# EAGLE design 2030_LED_Driver (EAGLE 7.7.0)
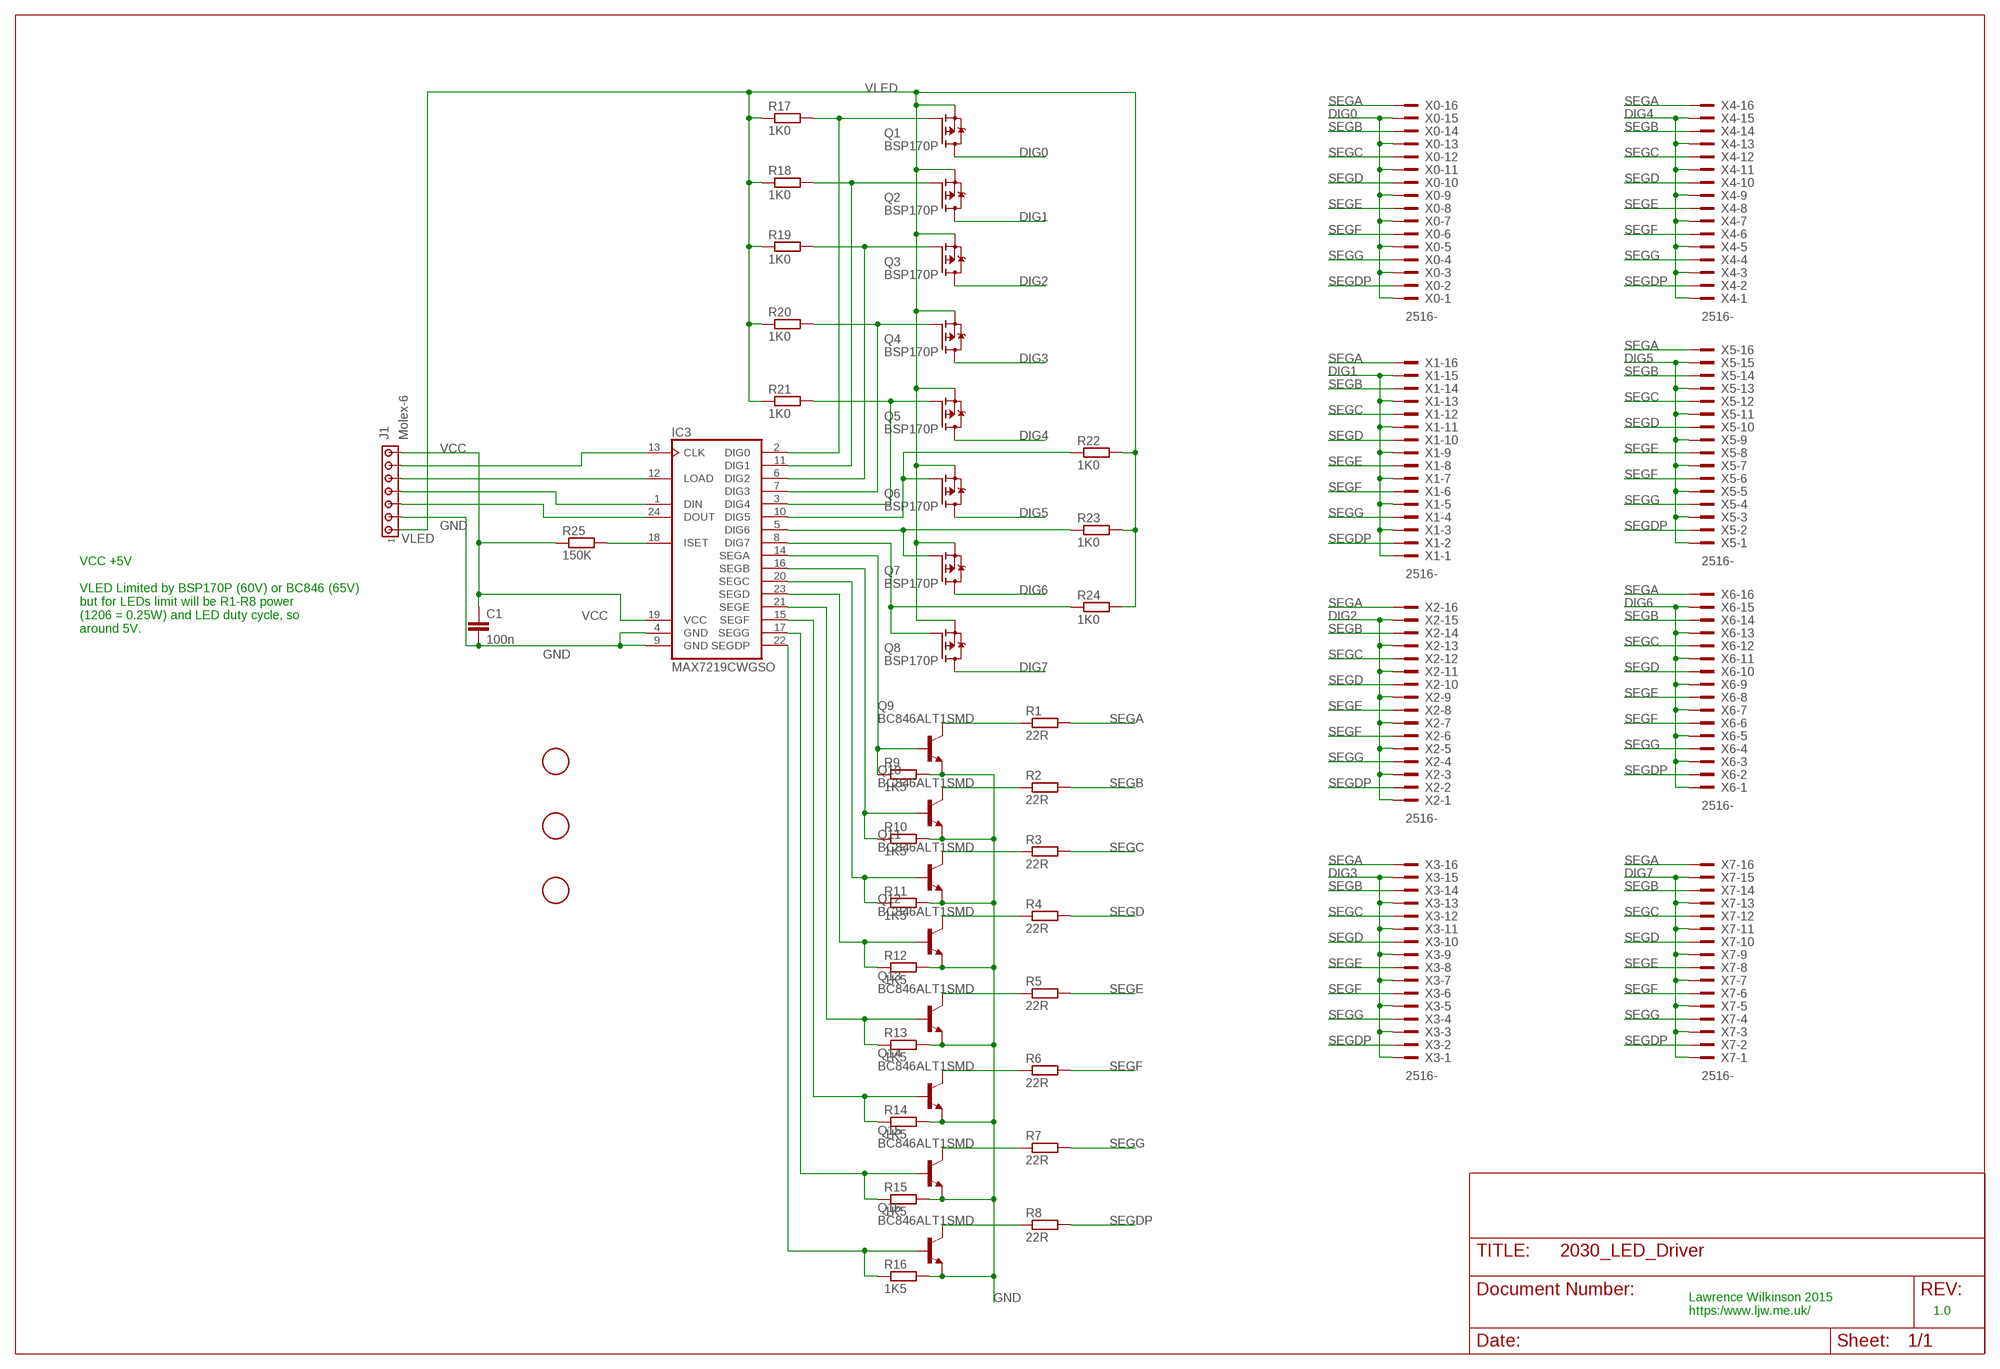
[diagram p0: schematic, sheet 1]

## Parts
C1  100n  C-EUC1206  [C1206]
IC3  MAX7219CWGSO  [SO24L]
J1  Molex-6  MTA07-100  [10X07MTA]
Q1  BSP170P  [SOT223]
Q2  BSP170P  [SOT223]
Q3  BSP170P  [SOT223]
Q4  BSP170P  [SOT223]
Q5  BSP170P  [SOT223]
Q6  BSP170P  [SOT223]
Q7  BSP170P  [SOT223]
Q8  BSP170P  [SOT223]
Q9  BC846ALT1SMD  [SOT23]
Q10  BC846ALT1SMD  [SOT23]
Q11  BC846ALT1SMD  [SOT23]
Q12  BC846ALT1SMD  [SOT23]
Q13  BC846ALT1SMD  [SOT23]
Q14  BC846ALT1SMD  [SOT23]
Q15  BC846ALT1SMD  [SOT23]
Q16  BC846ALT1SMD  [SOT23]
R1  22R  R-EU_M1206  [M1206]
R2  22R  R-EU_M1206  [M1206]
R3  22R  R-EU_M1206  [M1206]
R4  22R  R-EU_M1206  [M1206]
R5  22R  R-EU_M1206  [M1206]
R6  22R  R-EU_M1206  [M1206]
R7  22R  R-EU_M1206  [M1206]
R8  22R  R-EU_M1206  [M1206]
R9  1K5  R-EU_M0805  [M0805]
R10  1K5  R-EU_M0805  [M0805]
R11  1K5  R-EU_M0805  [M0805]
R12  1K5  R-EU_M0805  [M0805]
R13  1K5  R-EU_M0805  [M0805]
R14  1K5  R-EU_M0805  [M0805]
R15  1K5  R-EU_M0805  [M0805]
R16  1K5  R-EU_M0805  [M0805]
R17  1K0  R-EU_M0805  [M0805]
R18  1K0  R-EU_M0805  [M0805]
R19  1K0  R-EU_M0805  [M0805]
R20  1K0  R-EU_M0805  [M0805]
R21  1K0  R-EU_M0805  [M0805]
R22  1K0  R-EU_M0805  [M0805]
R23  1K0  R-EU_M0805  [M0805]
R24  1K0  R-EU_M0805  [M0805]
R25  150K  R-EU_M0805  [M0805]
U$1  FIDUCIAL  [FIDUCIAL_1MM]
U$2  FIDUCIAL  [FIDUCIAL_1MM]
U$3  FIDUCIAL  [FIDUCIAL_1MM]
X0  2516-  [PAK100/2500-16]
X1  2516-  [PAK100/2500-16]
X2  2516-  [PAK100/2500-16]
X3  2516-  [PAK100/2500-16]
X4  2516-  [PAK100/2500-16]
X5  2516-  [PAK100/2500-16]
X6  2516-  [PAK100/2500-16]
X7  2516-  [PAK100/2500-16]

## Nets
CLK: IC3.13(CLK) J1.6
DIG0 [supply]: Q1.2(D) Q1.4(D) X0.1 X0.3 X0.5 X0.7 X0.9 X0.11 X0.13 X0.15
DIG1 [supply]: Q2.2(D) Q2.4(D) X1.1 X1.3 X1.5 X1.7 X1.9 X1.11 X1.13 X1.15
DIG2 [supply]: Q3.2(D) Q3.4(D) X2.1 X2.3 X2.5 X2.7 X2.9 X2.11 X2.13 X2.15
DIG3 [supply]: Q4.2(D) Q4.4(D) X3.1 X3.3 X3.5 X3.7 X3.9 X3.11 X3.13 X3.15
DIG4 [supply]: Q5.2(D) Q5.4(D) X4.1 X4.3 X4.5 X4.7 X4.9 X4.11 X4.13 X4.15
DIG5 [supply]: Q6.2(D) Q6.4(D) X5.1 X5.3 X5.5 X5.7 X5.9 X5.11 X5.13 X5.15
DIG6 [supply]: Q7.2(D) Q7.4(D) X6.1 X6.3 X6.5 X6.7 X6.9 X6.11 X6.13 X6.15
DIG7 [supply]: Q8.2(D) Q8.4(D) X7.1 X7.3 X7.5 X7.7 X7.9 X7.11 X7.13 X7.15
DIN: IC3.1(DIN) J1.4
DOUT: IC3.24(DOUT) J1.3
GND [supply]: C1.2 IC3.4(GND) IC3.9(GND) J1.2 Q9.2(E) Q10.2(E) Q11.2(E) Q12.2(E) Q13.2(E) Q14.2(E) Q15.2(E) Q16.2(E) R9.2 R10.2 R11.2 R12.2 R13.2 R14.2 R15.2 R16.2
LOAD: IC3.12(LOAD) J1.5
N$2: IC3.2(DIG0) Q1.1(G) R17.2
N$3: IC3.11(DIG1) Q2.1(G) R18.2
N$4: IC3.6(DIG2) Q3.1(G) R19.2
N$5: IC3.7(DIG3) Q4.1(G) R20.2
N$6: IC3.3(DIG4) Q5.1(G) R21.2
N$7: IC3.10(DIG5) Q6.1(G) R22.1
N$8: IC3.5(DIG6) Q7.1(G) R23.1
N$9: IC3.8(DIG7) Q8.1(G) R24.1
N$10: IC3.18(ISET) R25.2
N$17: Q9.3(C) R1.1
N$18: Q10.3(C) R2.1
N$19: Q11.3(C) R3.1
N$20: Q12.3(C) R4.1
N$21: Q13.3(C) R5.1
N$22: IC3.14(SEGA) Q9.1(B) R9.1
N$23: IC3.16(SEGB) Q10.1(B) R10.1
N$24: IC3.20(SEGC) Q11.1(B) R11.1
N$25: IC3.23(SEGD) Q12.1(B) R12.1
N$26: IC3.21(SEGE) Q13.1(B) R13.1
N$27: IC3.15(SEGF) Q14.1(B) R14.1
N$28: IC3.17(SEGG) Q15.1(B) R15.1
N$29: IC3.22(SEGDP) Q16.1(B) R16.1
N$30: Q14.3(C) R6.1
N$31: Q15.3(C) R7.1
N$32: Q16.3(C) R8.1
SEGA: R1.2 X0.16 X1.16 X2.16 X3.16 X4.16 X5.16 X6.16 X7.16
SEGB: R2.2 X0.14 X1.14 X2.14 X3.14 X4.14 X5.14 X6.14 X7.14
SEGC: R3.2 X0.12 X1.12 X2.12 X3.12 X4.12 X5.12 X6.12 X7.12
SEGD: R4.2 X0.10 X1.10 X2.10 X3.10 X4.10 X5.10 X6.10 X7.10
SEGDP: R8.2 X0.2 X1.2 X2.2 X3.2 X4.2 X5.2 X6.2 X7.2
SEGE: R5.2 X0.8 X1.8 X2.8 X3.8 X4.8 X5.8 X6.8 X7.8
SEGF: R6.2 X0.6 X1.6 X2.6 X3.6 X4.6 X5.6 X6.6 X7.6
SEGG: R7.2 X0.4 X1.4 X2.4 X3.4 X4.4 X5.4 X6.4 X7.4
VCC: C1.1 IC3.19(VCC) J1.7 R25.1
VLED [supply]: J1.1 Q1.3(S) Q2.3(S) Q3.3(S) Q4.3(S) Q5.3(S) Q6.3(S) Q7.3(S) Q8.3(S) R17.1 R18.1 R19.1 R20.1 R21.1 R22.2 R23.2 R24.2

## Notes on the sheet
- VCC +5V
  
  VLED Limited by BSP170P (60V) or BC846 (65V)
  but for LEDs limit will be R1-R8 power
  (1206 = 0.25W) and LED duty cycle, so
  around 5V.
- Lawrence Wilkinson 2015
  https:/www.ljw.me.uk/
- 1.0

## Library data of the parts
C1 = resistor:C-EU: CAPACITOR, European symbol
IC3 = maxim:MAX7219CWG: LED DISPLAY DRIVER
J1 = con-amp:MTA07-100: AMP connector
Q1-Q8 = transistor-fet:BSP170P: SIPMOS(R) Small-Signal-Transistor P-Channel, Enhancement mode Source: http://www.infineon.com/upload/Document/BSP170P_Rev2.4.pdf
Q9-Q16 = transistor-npn:BC846*: NPN Transistor
R1-R25 = resistor:R-EU_: RESISTOR, European symbol
U$1-U$3 = adafruit:FIDUCIAL: For use by pick and place machines to calibrate the vision/machine, 1mm By microbuilder.eu
X0 X1-X7 = con-3m:2516-: 3M (TM) Pak 100 4-Wall Header Source: 3M; OC_FARNELL: unknown; OC_NEWARK: unknown

## Net classes
0 default: width 0.406 mm
1 supply: width 0.61 mm

## Board
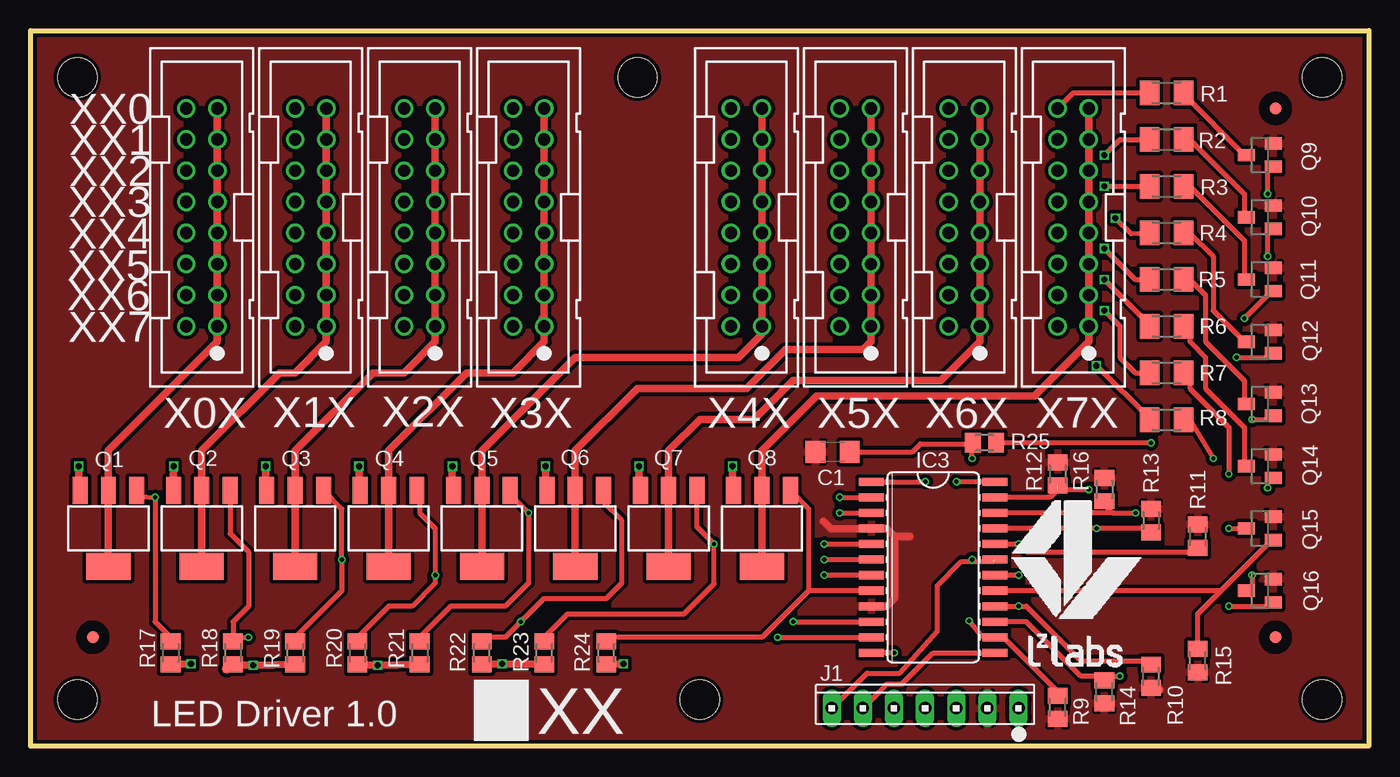
[diagram p1: board, top side]
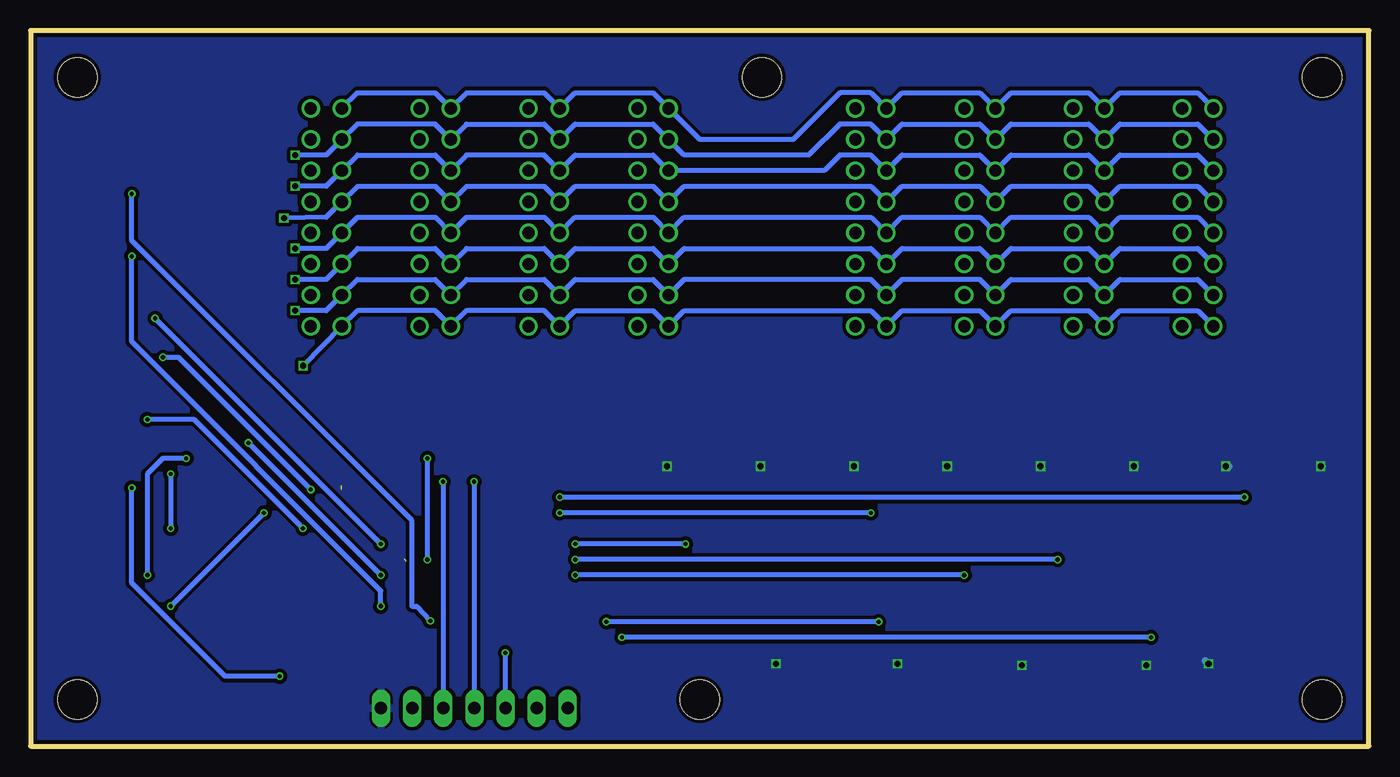
[diagram p2: board, bottom side, seen from below]

Size 109.22 x 58.42 mm. Coordinates in mm from the lower left corner, seen from the top.
Outline: 0,0 0,58.42 109.22,58.42 109.22,0 0,0
Copper layers (1*16): Top 0.018mm / dielectric 1.55mm / Bottom 0.018mm
Design rules "eC_2Layer_PClass6_BaseCopperO18_eCDefault": minimum track width 0.15mm, minimum drill 0.35mm, track to track 0.15mm, track to pad 0.15mm, pad to pad 0.15mm, via to via 0.15mm, smd to smd 0mil, copper to edge 0.25mm, drill to drill 0.35mm, minimum pad ring 0.175mm, minimum via ring 0.125mm, stop-mask expansion 0mil, vias tented up to drill 0.45mm, thermal gap 0.2mm
Holes 3.2 mm at 3.81,54.61 3.81,3.81 105.41,3.81 105.41,54.61 49.53,54.61 54.61,3.81
tKeepout: area 45.7,50.8 to 53.3,58.4; area 101.6,50.8 to 109.2,58.4; area 101.6,0 to 109.2,7.6; area 50.8,0 to 58.4,7.6; area 0,0 to 7.6,7.6; area 0,0 to 7.6,7.6; area 0,50.8 to 7.6,58.4
bKeepout: area 0,50.8 to 7.6,58.4; area 45.7,50.8 to 53.3,58.4; area 0,0 to 7.6,7.6; area 50.8,0 to 58.4,7.6; area 101.6,0 to 109.2,7.6; area 101.6,50.8 to 109.2,58.4

### Footprints (pad centres in the part's own frame; a part is rotated, then mirrored left to right if it is on the bottom)
C1206 = smd 1.6 x 1.8: 1 -1.4,0; 2 1.4,0
SO24L = smd 0.66 x 2.032: 1 -6.985,-5.029; 2 -5.715,-5.029; 3 -4.445,-5.029; 4 -3.175,-5.029; 5 -1.905,-5.029; 6 -0.635,-5.029; 7 0.635,-5.029; 8 1.905,-5.029; 9 3.175,-5.029; 10 4.445,-5.029; 11 5.715,-5.029; 12 6.985,-5.029; 13 6.985,5.029; 14 5.715,5.029; 15 4.445,5.029; 16 3.175,5.029; 17 1.905,5.029; 18 0.635,5.029; 19 -0.635,5.029; 20 -1.905,5.029; 21 -3.175,5.029; 22 -4.445,5.029; 23 -5.715,5.029; 24 -6.985,5.029
10X07MTA = drill 1.016 long: 1 7.62,0; 2 5.08,0; 3 2.54,0; 4 0,0; 5 -2.54,0; 6 -5.08,0; 7 -7.62,0
SOT223 = smd 1.219 x 2.235: 1 -2.311,-3.099; 2 0,-3.099; 3 2.311,-3.099 | smd 3.6 x 2.2: 4 0,3.099
SOT23 = smd 1 x 1.4: 1 -0.95,-1.1; 2 0.95,-1.1; 3 0,1.1
M1206 = smd 1.6 x 2: 1 -1.4,0; 2 1.4,0
M0805 = smd 1.3 x 1.6: 1 -0.95,0; 2 0.95,0
FIDUCIAL_1MM = smd 1 x 1: 1 0,0
PAK100/2500-16 = drill 1 pad 1.422: 1 -8.89,-1.27; 2 -8.89,1.27; 3 -6.35,-1.27; 4 -6.35,1.27; 5 -3.81,-1.27; 6 -3.81,1.27; 7 -1.27,-1.27; 8 -1.27,1.27; 9 1.27,-1.27; 10 1.27,1.27; 11 3.81,-1.27; 12 3.81,1.27; 13 6.35,-1.27; 14 6.35,1.27; 15 8.89,-1.27; 16 8.89,1.27

### Placement (x,y rotation side)
C1  65.46,24.03 180 top
IC3  73.66,14.61 270 top
J1  73,3.1 0 top
Q1  6.35,17.78 180 top
Q2  13.97,17.78 180 top
Q3  21.59,17.78 180 top
Q4  29.21,17.78 180 top
Q5  36.83,17.78 180 top
Q6  44.45,17.78 180 top
Q7  52.07,17.78 180 top
Q8  59.69,17.78 180 top
Q9  100.33,48.26 90 top
Q10  100.33,43.18 90 top
Q11  100.33,38.1 90 top
Q12  100.33,33.02 90 top
Q13  100.33,27.94 90 top
Q14  100.33,22.86 90 top
Q15  100.33,17.78 90 top
Q16  100.33,12.7 90 top
R1  92.71,53.34 180 top
R2  92.71,49.53 180 top
R3  92.71,45.72 180 top
R4  92.71,41.91 180 top
R5  92.71,38.1 180 top
R6  92.71,34.29 180 top
R7  92.71,30.48 180 top
R8  92.71,26.67 180 top
R9  83.82,3.17 270 top
R10  91.44,5.71 270 top
R11  95.25,17.14 90 top
R12  83.82,22.23 90 top
R13  91.44,18.41 90 top
R14  87.63,4.45 270 top
R15  95.25,6.99 270 top
R16  87.63,20.95 90 top
R17  11.43,7.62 90 top
R18  16.51,7.62 90 top
R19  21.59,7.62 90 top
R20  26.67,7.62 90 top
R21  31.75,7.62 90 top
R22  36.83,7.62 270 top
R23  41.91,7.62 270 top
R24  46.99,7.62 270 top
R25  77.85,24.77 0 top
U$1  5.08,8.89 0 top
U$2  101.6,8.89 0 top
U$3  101.6,52.07 0 top
X0  13.97,43.18 90 top
X1  22.86,43.18 90 top
X2  31.75,43.18 90 top
X3  40.64,43.18 90 top
X4  58.42,43.18 90 top
X5  67.31,43.18 90 top
X6  76.2,43.18 90 top
X7  85.09,43.18 90 top

### Tracks (layer width: path | path; a pad name or v marks a point on that pad's centre or on a via)
CLK
  Top 0.406: IC3.13 73.66,7.62 71.12,5.08 69.85,5.08 69.22,4.39 J1.6
DIG0
  Top 0.61: X0.15 X0.13 X0.11 X0.9 X0.7 X0.5 X0.3 X0.1 15.24,33.02 6.35,24.13 Q1.2 Q1.4
DIG1
  Top 0.61: X1.15 X1.13 X1.11 X1.9 X1.7 X1.5 X1.3 X1.1 24.13,33.02 21.59,30.48 20.32,30.48 13.97,24.13 Q2.2 Q2.4
DIG2
  Top 0.61: X2.1 X2.3 X2.5 X2.7 X2.9 X2.11 X2.13 X2.15 | X2.1 33.02,33.81 | Q3.4 Q3.2 21.59,24.13 27.94,30.48 30.48,30.48 33.02,33.02 X2.1
DIG3
  Top 0.61: X3.1 X3.3 X3.5 X3.7 X3.9 X3.11 X3.13 X3.15 | 41.75,34.92 X3.1 | Q4.4 Q4.2 29.21,24.13 35.56,30.48 39.37,30.48 41.91,33.02 X3.1
DIG4
  Top 0.61: X4.15 X4.13 X4.11 X4.9 X4.7 X4.5 X4.3 X4.1 59.69,33.66 57.78,31.75 44.45,31.75 36.83,24.13 Q5.2 Q5.4
DIG5
  Top 0.61: X5.15 X5.13 X5.11 X5.9 X5.7 X5.5 X5.3 X5.1 68.58,33.02 67.94,32.38 61.59,32.38 58.42,29.21 49.53,29.21 44.45,24.13 Q6.2 Q6.4
DIG6
  Top 0.61: X6.15 X6.13 X6.11 X6.9 X6.7 X6.5 X6.3 X6.1 77.47,33.02 74.3,29.84 62.23,29.84 59.05,26.67 54.61,26.67 52.07,24.13 Q7.2 Q7.4
DIG7
  Top 0.61: X7.15 X7.13 X7.11 X7.9 X7.7 X7.5 X7.3 X7.1 86.36,33.02 81.92,28.57 64.14,28.57 59.69,24.13 Q8.2 Q8.4
DIN  (via drill 0.35)
  Top 0.406: IC3.1 v73.03,21.59
  Bottom 0.406: v73.03,21.59 73.03,3.12 J1.4
DOUT  (via drill 0.35)
  Top 0.406: IC3.24 v75.56,21.59
  Bottom 0.406: v75.56,21.59 75.56,3.12 J1.3
GND
  Top 0.61: 95.25,5.79 R15.2 | IC3.9 69.85,11.43 70.48,12.06 70.48,17.14 | 70.48,17.14 69.85,17.78 IC3.4 68.61,17.75 65.3,17.75 64.69,18.37 | 71.75,17.14 70.48,17.14
  Top 0.813: 92.05,4.6 R10.2 | 83.66,2.06 R9.2 83.61,2.44
  pour Top (isolate 0.305): 0,58.42 109.22,58.42 109.22,0 0,0
LOAD  (via drill 0.35)
  Top 0.406: v70.48,7.62 IC3.12
  Bottom 0.406: J1.5 70.46,7.59 v70.48,7.62
N$2  (via drill 0.35)
  Top 0.406: Q1.1 8.89,20.4 v10.16,20.32 10.16,10.16 11.43,8.89 R17.2 | v66.04,20.32 IC3.2
  Bottom 0.406: v10.16,20.32 v66.04,20.32
N$3  (via drill 0.35)
  Top 0.406: Q2.1 16.28,17.37 17.78,15.88 17.78,11.43 16.51,10.16 16.51,8.89 | v60.96,8.89 IC3.11 | 16.51,8.89 v17.78,8.89 | 16.51,8.89 R18.2
  Bottom 0.406: v17.78,8.89 v60.96,8.89
N$4  (via drill 0.35)
  Top 0.406: R19.2 21.59,8.89 25.4,12.7 v25.4,15.24 25.4,19.38 Q3.1 | v64.77,15.24 IC3.6
  Bottom 0.406: v25.4,15.24 v64.77,15.24
N$5  (via drill 0.35)
  Top 0.406: Q4.1 31.75,20.65 31.75,19.05 33.02,17.78 v33.02,13.97 33.02,13.34 31.11,11.43 29.21,11.43 26.67,8.89 R20.2 | v64.77,13.97 IC3.7
  Bottom 0.406: v33.02,13.97 v64.77,13.97
N$6  (via drill 0.35)
  Top 0.406: Q5.1 39.14,20.55 v40.64,19.05 40.64,13.34 38.73,11.43 34.29,11.43 31.75,8.89 R21.2 | v66.04,19.05 IC3.3
  Bottom 0.406: v40.64,19.05 v66.04,19.05
N$7  (via drill 0.35)
  Top 0.406: 36.83,8.89 R22.1 37.15,8.89 38.73,8.89 v40.01,10.16 41.91,12.06 46.99,12.06 48.26,13.34 48.26,18.41 46.76,19.91 Q6.1 | v62.23,10.16 IC3.10
  Bottom 0.406: v40.01,10.16 v62.23,10.16
N$8  (via drill 0.35)
  Top 0.406: R23.1 41.91,8.89 43.81,10.79 53.31,10.79 55.78,13.26 v55.78,16.51 54.38,17.91 Q7.1 | v64.77,16.51 IC3.5
  Bottom 0.406: v55.78,16.51 v64.77,16.51
N$9
  Top 0.406: Q8.1 63.5,19.38 63.5,12.7 | 63.5,12.7 59.69,8.89 46.99,8.89 R24.1 | IC3.8 63.5,12.7
N$10  (via drill 0.35)
  Top 0.406: IC3.18 v80.64,13.97 | v91.44,24.77 R25.2
  Bottom 0.406: v80.64,13.97 v91.44,24.77
N$17
  Top 0.406: Q9.3 99.06,48.26 93.98,53.34 R1.1
N$18
  Top 0.406: Q10.3 99.06,43.18 99.06,45.09 94.61,49.53 R2.1
N$19
  Top 0.406: Q11.3 99.06,38.1 99.06,41.27 94.61,45.72 R3.1
N$20
  Top 0.406: Q12.3 99.06,33.02 96.52,35.56 96.52,40.01 94.61,41.91 R4.1
N$21
  Top 0.406: Q13.3 99.06,27.94 99.06,29.84 95.89,33.02 95.89,36.83 94.61,38.1 R5.1
N$22  (via drill 0.35)
  Top 0.406: v100.97,45.09 100.97,46.99 Q9.1 | v76.61,10.24 77.72,8.89 IC3.14 79.38,8.89 83.82,4.45 R9.1
  Bottom 0.406: v100.97,45.09 100.97,41.27 78.11,18.41 78.11,11.43 77.72,11.43 v76.61,10.24
N$23  (via drill 0.35)
  Top 0.406: v100.97,40.01 100.97,41.91 Q10.1 | IC3.16 v80.64,11.43 81.28,11.43 85.72,6.99 91.44,6.99 R10.1
  Bottom 0.406: v100.97,40.01 100.97,33.02 80.64,12.7 v80.64,11.43
N$24  (via drill 0.35)
  Top 0.406: v99.06,34.92 100.97,36.83 Q11.1 | IC3.20 v80.64,16.51 81.28,15.88 95.25,15.88 R11.1
  Bottom 0.406: v80.64,16.51 v99.06,34.92
N$25  (via drill 0.35)  (1 unrouted)
  Top 0.406: v86.36,20.95 83.82,20.95 83.19,20.32 IC3.23 | Q12.1 100.97,31.75 v98.42,31.75
  Bottom 0.406: v98.42,31.75 97.16,31.75 v86.36,20.95
N$26  (via drill 0.35)
  Top 0.406: v99.69,26.67 100.97,26.67 Q13.1 | R13.1 91.44,17.78 v87,17.78 IC3.21
  Bottom 0.406: v99.69,26.67 95.89,26.67 v87,17.78
N$27  (via drill 0.35)
  Top 0.406: v100.97,21.08 100.97,21.59 Q14.1 | 87.63,5.71 v88.9,5.71 | IC3.15 81.28,10.16 85.72,5.71 87.63,5.71 | 87.63,5.71 R14.1
  Bottom 0.406: v100.97,21.08 100.97,13.34 93.34,5.71 v88.9,5.71
N$28
  Top 0.406: 97.16,12.7 95.25,10.79 R15.1 | 97.16,12.7 100.97,16.51 Q15.1 | 97.16,12.7 IC3.17
N$29  (via drill 0.35)
  Top 0.406: v97.79,11.43 100.97,11.43 Q16.1 | 88.27,19.05 v90.17,19.05 | 88.27,19.05 87.63,19.68 R16.1 | 88.27,19.05 IC3.22
  Bottom 0.406: v90.17,19.05 v97.79,11.43
N$30
  Top 0.406: Q14.3 99.06,22.86 99.06,26.04 95.89,29.21 95.89,31.75 94.61,33.02 94.61,34.29 R6.1
N$31  (via drill 0.35)
  Top 0.406: v97.79,17.78 Q15.3 | v97.79,22.23 97.79,26.04 94.61,29.21 94.61,30.48 R7.1
  Bottom 0.406: v97.79,22.23 v97.79,17.78
N$32  (via drill 0.35)
  Top 0.406: v99.69,13.97 99.69,12.7 Q16.3 | v96.52,23.5 94.61,26.67 R8.1
  Bottom 0.406: v96.52,23.5 98.42,23.5 99.69,22.23 v99.69,13.97
SEGA
  Top 0.406: R1.2 85.09,53.34 X7.16
  Bottom 0.406: X0.16 13.97,53.34 20.32,53.34 X1.16 22.86,53.34 29.21,53.34 X2.16 31.75,53.34 38.1,53.34 X3.16 40.64,53.34 43.18,53.34 46.99,49.53 54.61,49.53 X4.16 58.42,53.34 64.77,53.34 X5.16 67.31,53.34 73.66,53.34 X6.16 76.2,53.34 82.55,53.34 X7.16
SEGB  (via drill 0.5)
  Top 0.406: v87.63,48.26 88.9,49.53 R2.2
  Bottom 0.406: X0.14 13.97,50.8 20.32,50.8 X1.14 22.86,50.8 29.21,50.8 X2.14 31.75,50.8 38.1,50.8 X3.14 40.64,50.8 43.18,50.8 45.72,48.26 55.88,48.26 X4.14 58.42,50.8 64.77,50.8 X5.14 67.31,50.8 73.66,50.8 X6.14 76.2,50.8 82.55,50.8 X7.14 85.09,48.26 v87.63,48.26
SEGC  (via drill 0.5)
  Top 0.406: v87.63,45.72 R3.2
  Bottom 0.406: X0.12 13.97,48.26 20.32,48.26 X1.12 22.86,48.26 29.21,48.26 X2.12 31.75,48.26 38.1,48.26 X3.12 40.64,48.26 43.18,48.26 44.45,46.99 X4.12 58.42,48.26 64.77,48.26 X5.12 67.31,48.26 73.66,48.26 X6.12 76.2,48.26 82.55,48.26 X7.12 85.09,45.72 v87.63,45.72
SEGD  (via drill 0.5)
  Top 0.406: v88.54,43.1 89.81,41.83 R4.2
  Bottom 0.406: X0.10 13.97,45.72 20.32,45.72 X1.10 22.86,45.72 29.21,45.72 X2.10 31.75,45.72 38.1,45.72 X3.10 40.64,45.72 55.88,45.72 X4.10 58.42,45.72 64.77,45.72 X5.10 67.31,45.72 73.66,45.72 X6.10 76.2,45.72 82.55,45.72 X7.10 85.09,43.18 v88.54,43.1
SEGDP  (via drill 0.5)
  Top 0.406: v86.97,31.06 91.31,26.8 R8.2
  Bottom 0.406: X0.2 13.97,35.56 20.32,35.56 X1.2 22.86,35.56 29.21,35.56 X2.2 31.75,35.56 38.1,35.56 X3.2 40.64,35.56 55.88,35.56 X4.2 58.42,35.56 64.77,35.56 X5.2 67.31,35.56 73.66,35.56 X6.2 76.2,35.56 82.55,35.56 X7.2 v86.97,31.06
SEGE  (via drill 0.5)
  Top 0.406: v87.63,40.64 90.17,38.1 R5.2
  Bottom 0.406: X0.8 13.97,43.18 20.32,43.18 X1.8 22.86,43.18 29.21,43.18 X2.8 31.75,43.18 38.1,43.18 X3.8 40.64,43.18 55.88,43.18 X4.8 58.42,43.18 64.77,43.18 X5.8 67.31,43.18 73.66,43.18 X6.8 76.2,43.18 82.55,43.18 X7.8 85.09,40.64 v87.63,40.64
SEGF  (via drill 0.5)
  Top 0.406: v87.63,38.1 91.31,34.42 R6.2
  Bottom 0.406: X0.6 13.97,40.64 20.32,40.64 X1.6 22.86,40.64 29.21,40.64 X2.6 31.75,40.64 38.1,40.64 X3.6 40.64,40.64 55.88,40.64 X4.6 58.42,40.64 64.77,40.64 X5.6 67.31,40.64 73.66,40.64 X6.6 76.2,40.64 82.55,40.64 X7.6 85.09,38.1 v87.63,38.1
SEGG  (via drill 0.5)
  Top 0.406: v87.63,35.56 88.9,34.29 88.9,31.75 90.17,30.48 R7.2
  Bottom 0.406: X0.4 13.97,38.1 20.32,38.1 X1.4 22.86,38.1 29.21,38.1 X2.4 31.75,38.1 38.1,38.1 X3.4 40.64,38.1 55.88,38.1 X4.4 58.42,38.1 64.77,38.1 X5.4 67.31,38.1 73.66,38.1 X6.4 76.2,38.1 82.55,38.1 X7.4 85.09,35.56 v87.63,35.56
VCC  (via drill 0.35)  (1 unrouted)
  Top 0.406: 76.83,15.09 75.97,15.09 73.99,13.11 73.99,9.37 70.94,5.97 68.28,5.97 67.51,5.23 J1.7 | 76.83,15.09 78.54,15.09 | C1.1 71.96,24.03 72.62,24.69 76.83,24.69 | v76.83,23.5 76.83,24.77 R25.1 | v76.83,15.24 76.83,15.09
  Top 0.813: 76.83,24.69 R25.1
  Bottom 0.406: v76.83,15.24 v76.83,23.5
VLED  (via drill 0.5)
  Top 0.61: Q7.3 49.69,20.8 v49.66,22.86 | 11.53,6.57 R17.1 10.95,6.51 | Q3.3 19.21,20.8 v19.18,22.86 | Q1.3 3.97,20.8 v3.94,22.86 | Q2.3 11.59,20.8 v11.68,22.86 | Q4.3 26.83,20.8 v26.8,22.86 | Q5.3 34.45,20.8 v34.42,22.86 | Q6.3 42.07,20.8 v42.04,22.86 | 57.31,20.64 Q8.3 57.31,20.95 v57.28,22.86 | 11.62,6.67 v13.08,6.73 | R18.1 v18.16,6.6 R19.1 | R20.1 v28.32,6.6 R21.1 | R22.2 v38.48,6.73 R23.2 | R24.2 v48.39,6.73
  Top 0.813: R18.1 16.35,6.67 16,6.33 | 11.62,6.67 11.53,6.57
  Bottom 0.61: v49.66,22.86 49.53,22.86 | v57.28,22.86 57.15,22.86 | v42.04,22.86 41.91,22.86 | v34.42,22.86 34.29,22.86 | v26.8,22.86 26.67,22.86 | v19.18,22.86 19.05,22.86 | v11.68,22.86 11.43,22.86 | v3.94,22.86 3.81,22.86 | v13.08,6.73 13.34,6.99
  pour Bottom (isolate 0.305): 0,58.42 109.22,58.42 109.22,0 0,0

### Text on the board
tNames: XX0 | XX1 | XX2 | XX3 | XX4 | XX5 | XX6 | XX7 | X0X | X1X | X2X | X3X | X4X | X5X | X6X | X7X | LED Driver 1.0 | XX